# Altium schematic sheet MCU.SchDoc
size A4; DocumentNumber: 1; SheetNumber: 1; SheetTotal: 3
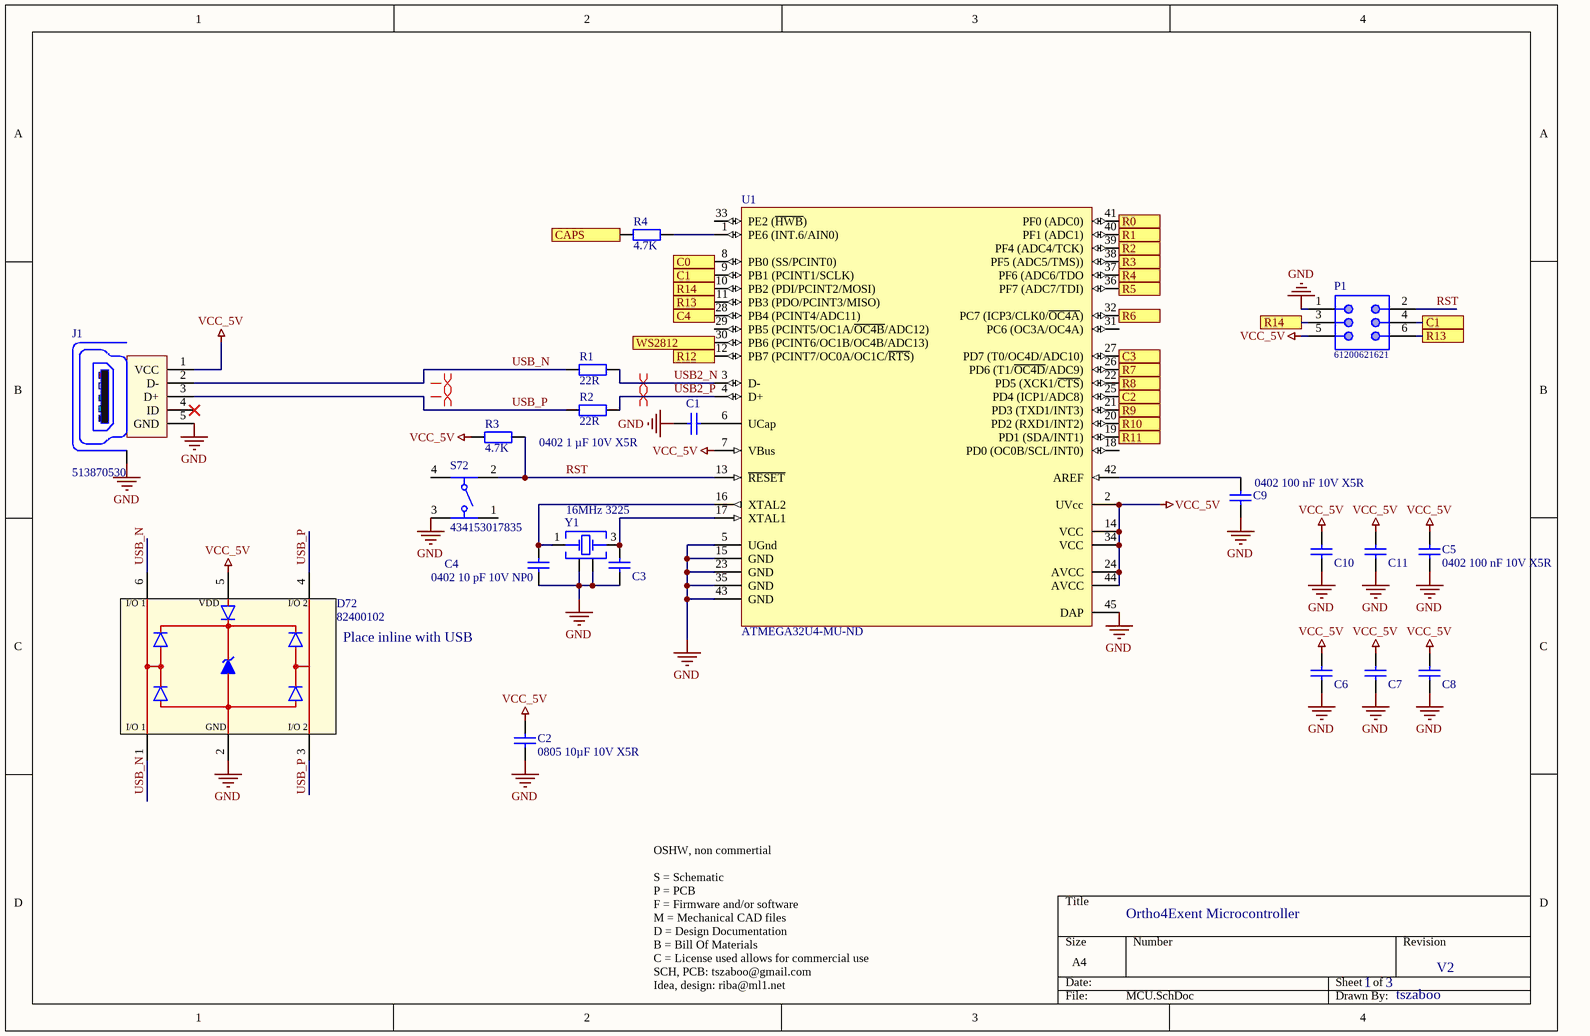
[diagram p0: MCU.SchDoc]

## Parts
C1  SCH: 0402 1 µF 10V X5R  [CAPC0402N]  (hidden comment: 0402 1µF)
C2  SCH: 0805 10µF 10V X5R  [CAPC0805N]  (hidden comment: 0805 10µF)
C3  0402 10pF  [CAPC0402N]  (value not drawn)
C4  SCH: 0402 10 pF 10V NP0  [CAPC0402N]  (hidden comment: 0402 10pF)
C5  SCH: 0402 100 nF 10V X5R  [CAPC0402N]  (hidden comment: 0402 100nF)
C6  0402 100nF  [CAPC0402N]  (value not drawn)
C7  0402 100nF  [CAPC0402N]  (value not drawn)
C8  0402 100nF  [CAPC0402N]  (value not drawn)
C9  SCH: 0402 100 nF 10V X5R  [CAPC0402N]  (hidden comment: 0402 100nF)
C10  0402 100nF  [CAPC0402N]  (value not drawn)
C11  0402 100nF  [CAPC0402N]  (value not drawn)
D72  82400102  [SOT23-6L]
J1  513870530  [513870530]
P1  61200621621  [61200621621]
R1  value 22R  [RESC0603N]  (hidden comment: RES 22R 0603)
R2  value 22R  [RESC0603N]  (hidden comment: RES 22R 0603)
R3  value 4.7K  [RESC0402N]  (hidden comment: RES 4.7K 0402)
R4  value 4.7K  [RESC0402N]  (hidden comment: RES 4.7K 0402)
S72  434153017835  [434153017835]
U1  ATMEGA32U4-MU-ND  [44PW_M]
Y1  16MHz 3225  [WE-XTAL_CFPX-180]

## Ports
C0, C1, C2, C3, C4, CAPS, R0, R1, R2, R3, R4, R5, R6, R7, R8, R9, R10, R11, R12, R13, R14, WS2812

## Nets
GND: C1.1 C2.1 C3.1 C4.1 C5.1 C6.1 C7.1 C8.1 C9.1 C10.1 C11.1 D72.2(GND) J1.5(GND) J1.TAB P1.1 S72.3 U1.5(UGnd) U1.15(GND) U1.23(GND) U1.35(GND) U1.43(GND) U1.45(DAP) Y1.2(GND) Y1.4(GND)
VCC_5V: C2.2 C5.2 C6.2 C7.2 C8.2 C10.2 C11.2 D72.5(VDD) J1.1(VCC) P1.5 R3.2 U1.2(UVcc) U1.7(VBus) U1.14(VCC) U1.24(AVCC) U1.34(VCC) U1.44(AVCC)
C0: U1.8(PB0_(SS/PCINT0)) ; port C0
C1: P1.4 U1.9(PB1_(PCINT1/SCLK)) ; port C1
C2: U1.25(PD4_(ICP1/ADC8)) ; port C2
C3: U1.27(PD7_(T0/OC4D/ADC10)) ; port C3
C4: U1.28(PB4_(PCINT4/ADC11)) ; port C4
CAPS: R4.2 ; port CAPS
R0: U1.41(PF0_(ADC0)) ; port R0
R1: U1.40(PF1_(ADC1)) ; port R1
R2: U1.39(PF4_(ADC4/TCK)) ; port R2
R3: U1.38(PF5_(ADC5/TMS))) ; port R3
R4: U1.37(PF6_(ADC6/TDO) ; port R4
R5: U1.36(PF7_(ADC7/TDI)) ; port R5
R6: U1.32(PC7_(ICP3/CLK0/~{OC4A})) ; port R6
R7: U1.26(PD6_(T1/~{OC4D}/ADC9)) ; port R7
R8: U1.22(PD5_(XCK1/~{CTS})) ; port R8
R9: U1.21(PD3_(TXD1/INT3)) ; port R9
R10: U1.20(PD2_(RXD1/INT2)) ; port R10
R11: U1.19(PD1_(SDA/INT1)) ; port R11
R12: U1.12(PB7_(PCINT7/OC0A/OC1C/~{RTS})) ; port R12
R13: P1.6 U1.11(PB3_(PDO/PCINT3/MISO)) ; port R13
R14: P1.3 U1.10(PB2_(PDI/PCINT2/MOSI)) ; port R14
RST: P1.2 R3.1 S72.2 U1.13(~{RESET})
USB2_N: R1.2 U1.3(D-)
USB2_P: R2.2 U1.4(D+)
USB_N: D72.1(I/O_1) D72.6(I/O_1) J1.2(D-) R1.1
USB_P: D72.3(I/O_2) D72.4(I/O_2) J1.3(D+) R2.1
WS2812: U1.30(PB6_(PCINT6/OC1B/OC4B/ADC13)) ; port WS2812
NetC1_2: C1.2 U1.6(UCap)
NetC3_2: C3.2 U1.17(XTAL1) Y1.3(Crystal)
NetC4_2: C4.2 U1.16(XTAL2) Y1.1(Crystal)
NetC9_2: C9.2 U1.42(AREF)
NetR4_1: R4.1 U1.1(PE6_(INT.6/AIN0))

Not connected (* = marked no-connect by the designer): J1 4(ID)*; S72 1 4; U1 18(PD0_(OC0B/SCL/INT0)) 29(PB5_(PCINT5/OC1A/~{OC4B}/ADC12)) 31(PC6_(OC3A/OC4A)) 33(PE2_(~{HWB}))

## Layout directives
differential pair: (no net found under the mark), USB2_N, USB2_P

## Notes on the sheet
- (near D72) Place inline with USB
- Ortho4Exent Microcontroller
- OSHW, non commertial
  S = Schematic
  P = PCB
  F = Firmware and/or software
  M = Mechanical CAD files
  D = Design Documentation
  B = Bill Of Materials
  C = License used allows for commercial use
  SCH, PCB: tszaboo@gmail.com
  Idea, design: riba@ml1.net
- 1
- 3
- V2
- tszaboo

## Library data of the parts
C1 = 885012105012: MANUF: WE; DESCIPTION: CAP SMD 0402 1 µF 10V X5R; NoPins: 2; SUPPLY: SUB; VOLTAGE: 10; TECH: X5R; COMPATIBLES: True; MANUFCODE: 885012105012; DIGIKEY: 732-7489-2-ND; SMD: YES; VALUE: 1 µF
C2 = 885012107010: MANUF: WE; DESCIPTION: CAP SMD 0805 10 µF 10 V X5R; NoPins: 2; SUPPLY: SUB; VOLTAGE: 10; TECH: X5R; COMPATIBLES: True; MANUFCODE: 885012107010; DIGIKEY: 732-7620-2-ND; SMD: YES; VALUE: 10 µF
C3 = 885012005007: MANUF: WE; SCH: 0402 10 pF 10V NP0; DESCIPTION: CAP SMD 0402 10 pF 10V NP0; NoPins: 2; SUPPLY: SUB; VOLTAGE: 10; TECH: NP0; COMPATIBLES: True; MANUFCODE: 885012005007; DIGIKEY: 732-7425-2-ND; SMD: YES; VALUE: 10 pF
C4 = 885012005007: MANUF: WE; DESCIPTION: CAP SMD 0402 10 pF 10V NP0; NoPins: 2; SUPPLY: SUB; VOLTAGE: 10; TECH: NP0; COMPATIBLES: True; MANUFCODE: 885012005007; DIGIKEY: 732-7425-2-ND; SMD: YES; VALUE: 10 pF
C5 C9 = 885012105010: MANUF: WE; DESCIPTION: CAP SMD 0402 100 nF 10V X5R; NoPins: 2; SUPPLY: SUB; VOLTAGE: 10; TECH: X5R; COMPATIBLES: True; MANUFCODE: 885012105010; DIGIKEY: 732-7487-2-ND; SMD: YES; VALUE: 100 nF
C6-C8 C10 C11 = 885012105010: MANUF: WE; SCH: 0402 100 nF 10V X5R; DESCIPTION: CAP SMD 0402 100 nF 10V X5R; NoPins: 2; SUPPLY: SUB; VOLTAGE: 10; TECH: X5R; COMPATIBLES: True; MANUFCODE: 885012105010; DIGIKEY: 732-7487-2-ND; SMD: YES; VALUE: 100 nF
D72 = WE-TVS, SOT23-6L, 82400102: WE-TVS TVS Diode, High Speed Series, SOT23-6L, VDC = 5V; MANUF: WE; COMPATIBLES: False; DESCIPTION: WE-TVS TVS Diode, High Speed Series, SOT23-6L, VDC = 5V; DIGIKEY: 732-4473-1-ND; MANUFCODE: 82400102
J1 = 513870530: Mini USB, B-Receptacle, Right-Angle, Short Body, Surface Mount Solder Tails and Through Hole Shell Tabs, with Cover Tape, Reflow DIP Type, Lead-Free; MANUF: MOLEX; DESCIPTION: USB - mini B USB 2.0 OTG Receptacle Connector 5 Position Surface Mount; COMPATIBLES: False; MANUFCODE: 513870530; DIGIKEY: WM3756TR-ND
P1 = 61200621621: Male Box Header WR-BHD, THT, Vertical, pitch 2.54 mm, 6 pins; COMPATIBLES: True
R1 R2 = CRCW060322R0FKEA: Resistor; MANUF: VISHAY; COMPATIBLES: True; NoPins: 2; SUPPLY: SUB; DESCIPTION: RES SMD 22 OHM 1% 1/10W 100PPM 0603; MANUFCODE: CRCW060322R0FKEA; DIGIKEY: 541-22.0HCT-ND; FARNELL: #N/A; SMD: YES; SCH: RES 22R 0603
R3 R4 = CRCW04024K70FKED: Resistor; MANUF: VISHAY; COMPATIBLES: True; NoPins: 2; SUPPLY: SUB; DESCIPTION: RES SMD 4.7K OHM 1% 1/16W 100PPM 0402; MANUFCODE: CRCW04024K70FKED; DIGIKEY: 541-4.70KLCT-ND; FARNELL: TBD; SMD: YES; SCH: RES 4.7K 0402
S72 = 434153017835: WS-TASV J-Bend SMT Tact Switch, 3.5x2.9x1.7mm, 350gf; MANUF: WE; DESCIPTION: SWITCH TACTILE SPST-NO 0.05A 12V; COMPATIBLES: True; MANUFCODE: 434153017835; DIGIKEY: 732-10143-1-ND
U1 = CMP-0095-00166-2: 8-bit AVR Microcontroller, 2.7-5.5V, 16MHz, 32KB Flash, 1KB EEPROM, 2.5KB SRAM, USB Controller, 44-pin QFN, Industrial Grade (-40°C to 85°C), Ext Osc; MANUF: Microchip; NoPins: 44; DESCIPTION: IC MCU 8BIT 32KB FLASH 44VQFN; COMPATIBLES: False; MANUFCODE: ATMEGA32U4-MU-ND; DIGIKEY: ATMEGA32U4-MU-ND
Y1 = 830055951: WE-XTAL Quartz Crystal, SMT, CFPX-180, 16MHz, +/-20ppm; MANUF: WE/IQD; DESCIPTION: CRYSTAL 16.0000MHZ 18PF SMD; COMPATIBLES: True; MANUFCODE: 830055951; DIGIKEY: 1923-1308-1-ND